# Altium project DVI Level Shifter.PrjPcb
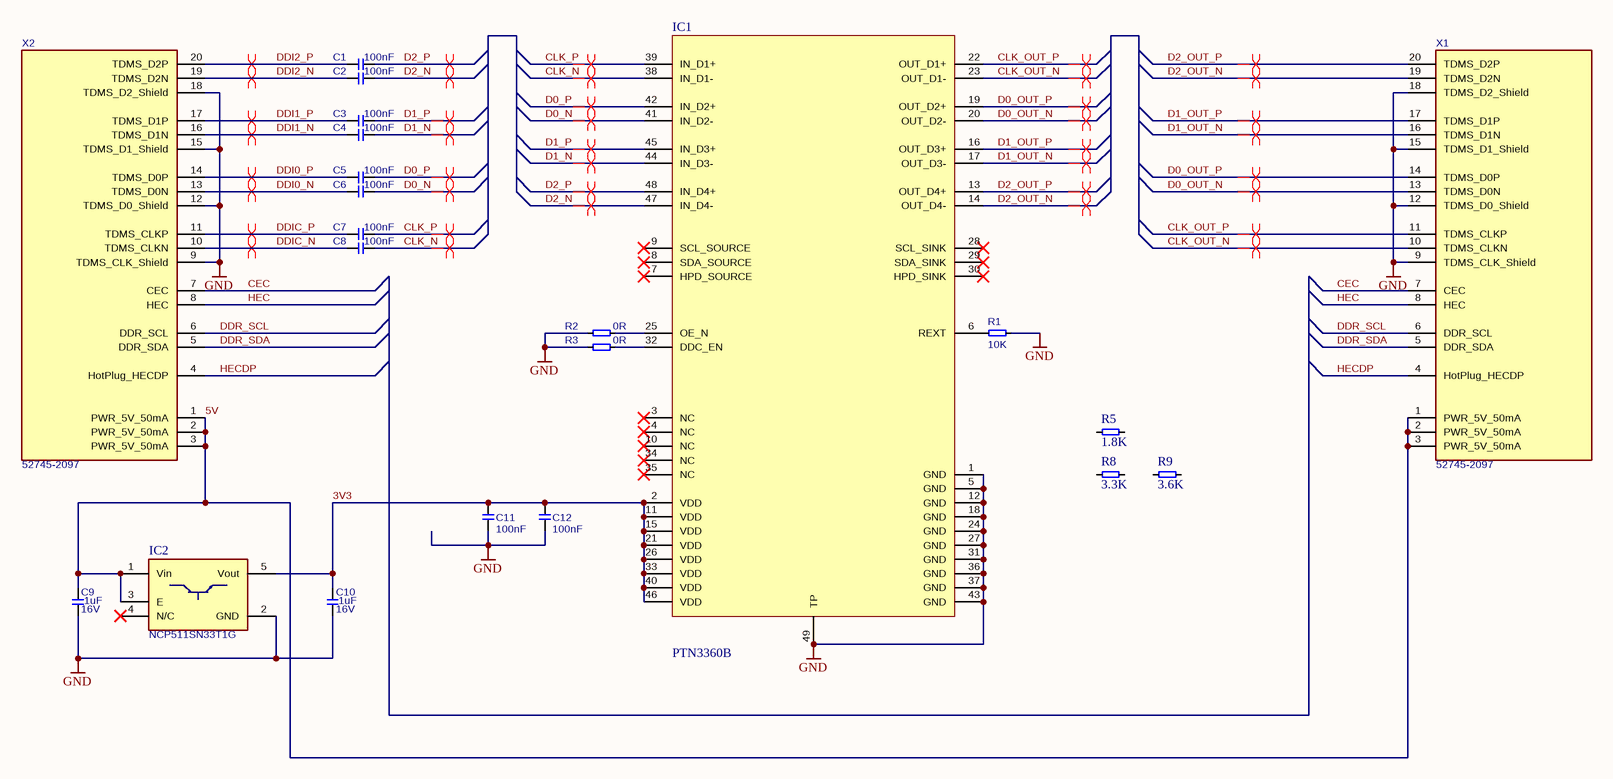
[diagram p0: DVI.SchDoc]
1 sheet, 22 parts. Net scope: global (net labels, ports and power ports of the same name join across sheets).
Board file: DVI.PcbDoc

## Sheet DVI.SchDoc
size A3

### Parts
C1  100nF  [T_CAPC0603X33N]
C2  100nF  [T_CAPC0603X33N]
C3  100nF  [T_CAPC0603X33N]
C4  100nF  [T_CAPC0603X33N]
C5  100nF  [T_CAPC0603X33N]
C6  100nF  [T_CAPC0603X33N]
C7  100nF  [T_CAPC0603X33N]
C8  100nF  [T_CAPC0603X33N]
C9  Rating: 16V  [T_CAPC0603X33N]  (hidden comment: 1uF)
C10  Rating: 16V  [T_CAPC0603X33N]  (hidden comment: 1uF)
C11  100nF  [T_CAPC0603X33N]
C12  100nF  [T_CAPC0603X33N]
IC1  PTN3360B  [TSQFP50P900X900X160-48N_TP]
IC2  NCP511SN33T1G  [SOT95P279X142-5N]
R1  10K  [T_RESC0603X30N]
R2  0R  [T_RESC0603X30N]
R3  0R  [T_RESC0603X30N]
R5  1.8K  [T_RESC0603X30N]
R8  3.3K  [T_RESC0603X30N]
R9  3.6K  [T_RESC0603X30N]
X1  52745-2097  [T_MOLEX_52745-2097_MIRROR]
X2  52745-2097  [T_MOLEX_52745-2097]

### Nets
GND: C9.1 C10.1 C11.1 C12.1 IC1.1(GND) IC1.5(GND) IC1.12(GND) IC1.18(GND) IC1.24(GND) IC1.27(GND) IC1.31(GND) IC1.36(GND) IC1.37(GND) IC1.43(GND) IC1.49(TP) IC2.2(GND) R1.2 R2.1 R3.1 X1.9(TDMS_CLK_Shield) X1.12(TDMS_D0_Shield) X1.15(TDMS_D1_Shield) X1.18(TDMS_D2_Shield) X2.9(TDMS_CLK_Shield) X2.12(TDMS_D0_Shield) X2.15(TDMS_D1_Shield) X2.18(TDMS_D2_Shield)
3V3: C10.2 C11.2 C12.2 IC1.2(VDD) IC1.11(VDD) IC1.15(VDD) IC1.21(VDD) IC1.26(VDD) IC1.33(VDD) IC1.40(VDD) IC1.46(VDD) IC2.5(Vout)
5V: C9.2 IC2.1(Vin) IC2.3(E) X1.1(PWR_5V_50mA) X1.2(PWR_5V_50mA) X1.3(PWR_5V_50mA) X2.1(PWR_5V_50mA) X2.2(PWR_5V_50mA) X2.3(PWR_5V_50mA)
CEC: X1.7(CEC) X2.7(CEC)
CLK_N: C8.2 IC1.38(IN_D1-)
CLK_OUT_N: IC1.23(OUT_D1-) X1.10(TDMS_CLKN)
CLK_OUT_P: IC1.22(OUT_D1+) X1.11(TDMS_CLKP)
CLK_P: C7.2 IC1.39(IN_D1+)
D0_N: C6.2 IC1.41(IN_D2-)
D0_OUT_N: IC1.20(OUT_D2-) X1.13(TDMS_D0N)
D0_OUT_P: IC1.19(OUT_D2+) X1.14(TDMS_D0P)
D0_P: C5.2 IC1.42(IN_D2+)
D1_N: C4.2 IC1.44(IN_D3-)
D1_OUT_N: IC1.17(OUT_D3-) X1.16(TDMS_D1N)
D1_OUT_P: IC1.16(OUT_D3+) X1.17(TDMS_D1P)
D1_P: C3.2 IC1.45(IN_D3+)
D2_N: C2.2 IC1.47(IN_D4-)
D2_OUT_N: IC1.14(OUT_D4-) X1.19(TDMS_D2N)
D2_OUT_P: IC1.13(OUT_D4+) X1.20(TDMS_D2P)
D2_P: C1.2 IC1.48(IN_D4+)
DDI0_N: C6.1 X2.13(TDMS_D0N)
DDI0_P: C5.1 X2.14(TDMS_D0P)
DDI1_N: C4.1 X2.16(TDMS_D1N)
DDI1_P: C3.1 X2.17(TDMS_D1P)
DDI2_N: C2.1 X2.19(TDMS_D2N)
DDI2_P: C1.1 X2.20(TDMS_D2P)
DDIC_N: C8.1 X2.10(TDMS_CLKN)
DDIC_P: C7.1 X2.11(TDMS_CLKP)
DDR_SCL: X1.6(DDR_SCL) X2.6(DDR_SCL)
DDR_SDA: X1.5(DDR_SDA) X2.5(DDR_SDA)
HEC: X1.8(HEC) X2.8(HEC)
HECDP: X1.4(HotPlug_HECDP) X2.4(HotPlug_HECDP)
NetIC1_6: IC1.6(REXT) R1.1
NetIC1_25: IC1.25(OE_N) R2.2
NetIC1_32: IC1.32(DDC_EN) R3.2

Not connected (* = marked no-connect by the designer): IC1 3(NC)* 4(NC)* 7(HPD_SOURCE)* 8(SDA_SOURCE)* 9(SCL_SOURCE)* 10(NC)* 28(SCL_SINK)* 29(SDA_SINK)* 30(HPD_SINK)* 34(NC)* 35(NC)*; IC2 4(N/C)*; R5 1 2; R8 1 2; R9 1 2

### Layout directives
differential pair: CLK_N, CLK_OUT_N, CLK_OUT_P, CLK_P, D0_N, D0_OUT_N, D0_OUT_P, D0_P, D1_N, D1_OUT_N, D1_OUT_P, D1_P, D2_N, D2_OUT_N, D2_OUT_P, D2_P, DDI0_N, DDI0_P, DDI1_N, DDI1_P, DDI2_N, DDI2_P, DDIC_N, DDIC_P

### Notes on the sheet
- Title
- Size:
- Date:
- A3
- Number:
- Time:
- Revision:
- Sheet
- of
- File:

### Library data of the parts
C1-C8 C11 C12 = C-X7R-100nF-16V-10%-0402: Capacitor Ceramic X7R 100nF 16V 10% 0402; Tolerance: 10%; Type: X7R; Value: 100nF
C9 C10 = C-X5R-1uF-16V-20%-0603: Capacitor Ceramic X5R 1uF 16V 20% 0603; Tolerance: 20%; Type: X5R; Value: 1uF
IC1 = IC-NXP-PTN3360B: PTN3360BBS,518; name: hello; part number: PTN3360B
IC2 = IC-ON-NCP511SN33T1G: NCP511SN33T1G LDO Regulator; Manufacturer Name: ON Semiconductor; Manufacturer Part No.: NCP511SN33T1G
R1 = R-10KR-63mW-1%-0603: Resistor 10 Kohm 63mW 1% 0603; Value: 10KR; Rating: 63mW; Tolerance: 1%
R2 R3 = R-0R-63mW-1%-0603: Resistor 0 ohm 63mW 1% 0603; Rating: 63mW; Tolerance: 1%; Value: 0R
R5 = R-1.8KR-63mW-5%-0603: Resistor 1.8 Kohm 63mW 5% 0603; Value: 1.8KR; Rating: 63mW; Tolerance: 5%
R8 = R-3.3KR-63mW-1%-0603: Resistor 3.3 Kohm 63mW 1% 0603; Value: 3.3KR; Rating: 63mW; Tolerance: 1%
R9 = R-3.6KR-63mW-1%-0603: Resistor 3.6 Kohm 100mW 1% 0603; Value: 3.6KR; Rating: 100mW; Tolerance: 1%
X1 X2 = CON-Molex-52745-2097-20-0.5mm: 0.50mm Pitch FFC/FPC DVI Connector; Manufacturer Name: Molex; No. of ways: 24; Pitch: 0.5mm; Manufacturer Part No.: 52745-2097